# EAGLE schematic PowerSupply (EAGLE 7.1.0)
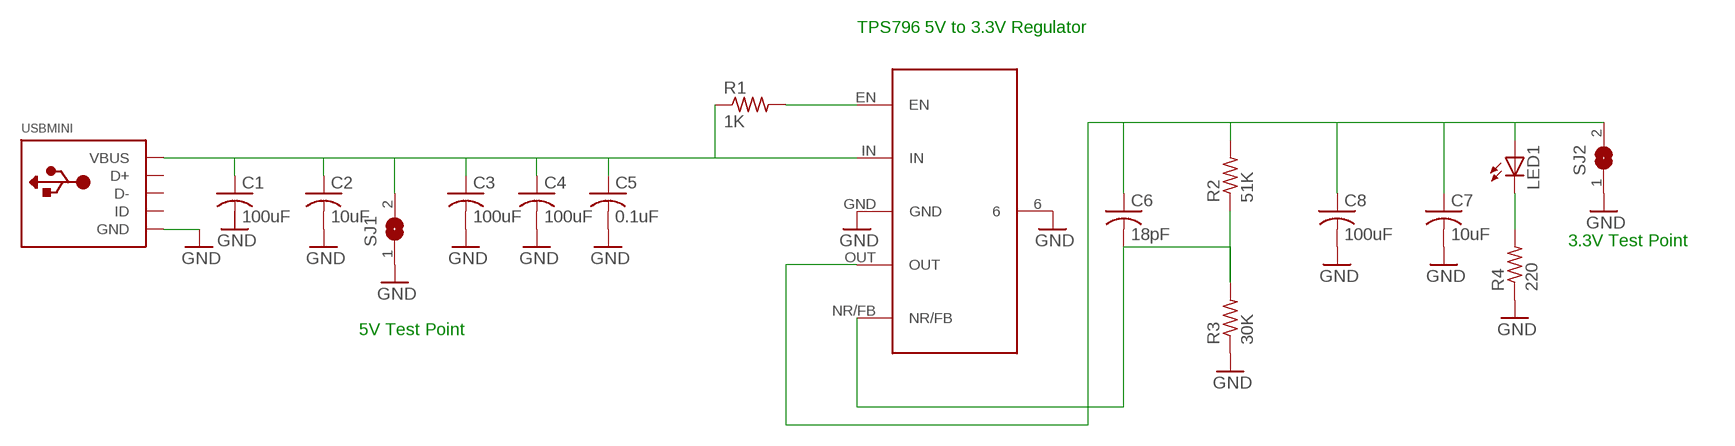
[diagram p0: schematic, sheet 1]

## Parts
C1  100uF  C-USC1206K  [C1206K]
C2  10uF  C-USC1206K  [C1206K]
C3  100uF  C-USC1206K  [C1206K]
C4  100uF  C-USC1206K  [C1206K]
C5  0.1uF  C-USC1206K  [C1206K]
C6  18pF  C-USC1206K  [C1206K]
C7  10uF  C-USC1206K  [C1206K]
C8  100uF  C-USC1206K  [C1206K]
LED1  LEDCHIPLED_0805  [CHIPLED_0805]
R1  1K  R-US_R0805  [R0805]
R2  51K  R-US_R0805  [R0805]
R3  30K  R-US_R0805  [R0805]
R4  220  R-US_R0805  [R0805]
SJ1  SJW  [SJW]
SJ2  SJW  [SJW]
U$1  TPS796  [TPS796]
USBMINI  USBMINIB  [USB-MINIB]

## Nets
GND: C2.2 C3.2 C4.2 C5.2 C7.2 C8.2 R3.1 R4.1 SJ1.1 SJ2.1 U$1.6 U$1.GND USBMINI.GND
N$1: C1.1 C2.1 C3.1 C4.1 C5.1 R1.1 SJ1.2 U$1.IN USBMINI.VBUS
N$2: LED1.C R4.2
N$3: R1.2 U$1.EN
N$4: C6.1 C7.1 C8.1 LED1.A R2.2 SJ2.2 U$1.OUT
N$5: C6.2 R2.1 R3.2 U$1.NR/FB
Unconnected: C1.2 USBMINI.D+ USBMINI.D- USBMINI.ID

## Notes on the sheet
- TPS796 5V to 3.3V Regulator
- 3.3V Test Point
- 5V Test Point

## Library data of the parts
C1-C8 = adafruit:C-US: CAPACITOR, American symbol
LED1 = adafruit:LED: LED OSRAM: - CHIPLED LG R971, LG N971, LY N971, LG Q971, LY Q971, LO R971, LY R971 LH N974, LH R974 LS Q976, LO Q976, LY Q976 LO Q996 - Hyper CHIPLED LW Q18S LB Q993, LB Q99A, LB R99A - SideLED LS A670, LO A670, LY A670, LG A670, LP A670 LB A673, LV A673, LT A673, LW A673 LH A674 LY A675 LS A676, LA A676, LO A676, LY A676, LW A676 LS A679, LY A679, LG A679 - Hyper Micro SIDELED® LS Y876, LA Y876, LO Y876, LY Y876 LT Y87S - SmartLED LW L88C, LW L88S LB L89C, LB L89S, LG L890 LS L89K, LO L89K, LY L89K LS L896, LA L896, LO L896, LY L896 - TOPLED LS T670, LO T670, LY T670, LG T670, LP T670 LSG T670, LSP T670, LSY T670, LOP T670, LYG T670 LG T671, LOG T671, LSG T671 LB T673, LV T673, LT T673, LW T673 LH T674 LS T676, LA T676, LO T676, LY T676, LB T676, LH T676, LSB T676, LW T676 LB T67C, LV T67C, LT T67C, LS T67K, LO T67K, LY T67K, LW E67C LS E67B, LA E67B, LO E67B, LY E67B, LB E67C, LV E67C, LT E67C LW T67C LS T679, LY T679, LG T679 LS T770, LO T770, LY T770, LG T770, LP T770 LB T773, LV T773, LT T773, LW T773 LH T774 LS E675, LA E675, LY E675, LS T675 LS T776, LA T776, LO T776, LY T776, LB T776 LHGB T686 LT T68C, LB T68C - Hyper Mini TOPLED® LB M676 - Mini TOPLED Santana® LG M470 LS M47K, LO M47K, LY M47K Source: http://www.osram.convergy.de/
R1-R4 = adafruit:R-US_: RESISTOR, American symbol
SJ1 SJ2 = jumper:SJ: SMD solder JUMPER
U$1 = Capstone:TPS796: LDO
USBMINI = adafruit:USB: USB Connectors USBMINIB - Surface Mount Female Mini-B USB Connector 4UConnector: 06564 By microbuilder.eu Thru-hole RA Female Mini-B USB Connector 4UConnector: 18732 By ladyada.net